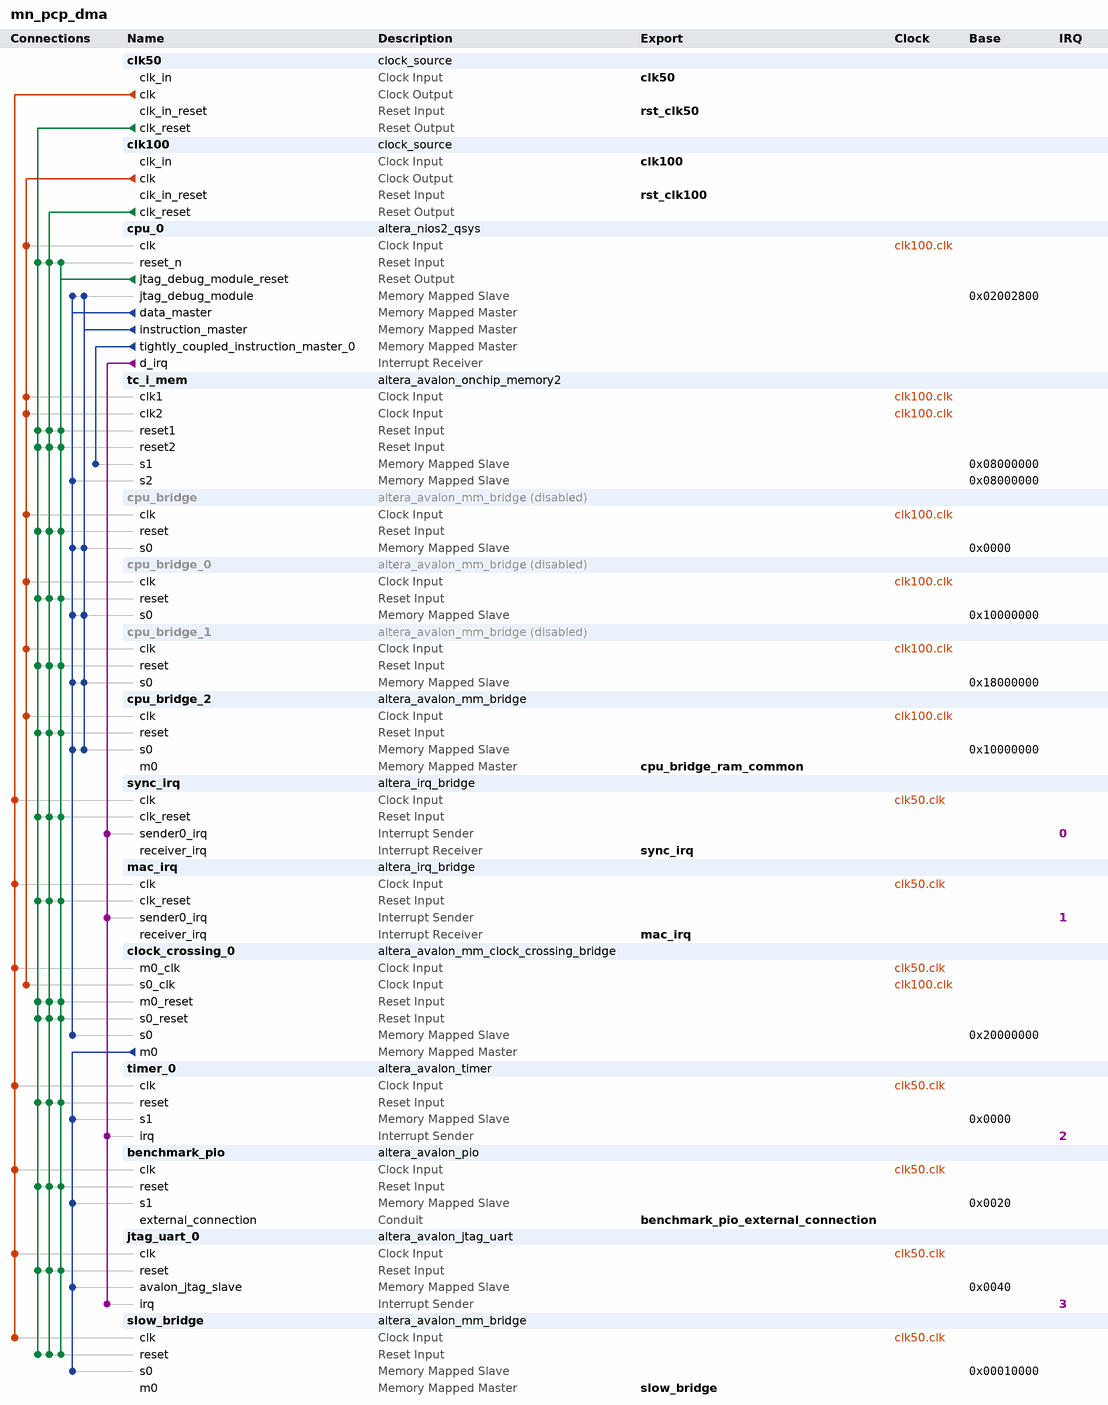
[diagram p0: system contents]
# Platform Designer (Qsys) system mn_pcp_dma, Cyclone IV GX EP4CGX150DF31C7
# Parameters at their usual value, and those the tool derives, are not listed.
package require -exact qsys 14.0
create_system mn_pcp_dma
set_project_property DEVICE_FAMILY {Cyclone IV GX}
set_project_property DEVICE EP4CGX150DF31C7

add_instance clk50 clock_source 14.0
set_instance_parameter_value clk50 clockFrequency 50000000

add_instance clk100 clock_source 14.0
set_instance_parameter_value clk100 clockFrequency 100000000

add_instance cpu_0 altera_nios2_qsys 14.0
set_instance_parameter_value cpu_0 muldiv_divider true
set_instance_parameter_value cpu_0 resetrequest_enabled true
set_instance_parameter_value cpu_0 cpuID 1
set_instance_parameter_value cpu_0 resetSlave tc_i_mem.s1
set_instance_parameter_value cpu_0 exceptionSlave tc_i_mem.s1
set_instance_parameter_value cpu_0 breakSlave cpu_0.jtag_debug_module
set_instance_parameter_value cpu_0 impl Fast
set_instance_parameter_value cpu_0 icache_size 4096
set_instance_parameter_value cpu_0 icache_numTCIM 1
set_instance_parameter_value cpu_0 dcache_size 4096
set_instance_parameter_value cpu_0 dcache_lineSize 4

add_instance tc_i_mem altera_avalon_onchip_memory2 14.0
set_instance_parameter_value tc_i_mem dataWidth 32
set_instance_parameter_value tc_i_mem dualPort true
set_instance_parameter_value tc_i_mem initMemContent true
set_instance_parameter_value tc_i_mem initializationFileName tc_i_mem
set_instance_parameter_value tc_i_mem memorySize 20480

add_instance cpu_bridge altera_avalon_mm_bridge 14.0
set_instance_property cpu_bridge ENABLED false
set_instance_parameter_value cpu_bridge DATA_WIDTH 32
set_instance_parameter_value cpu_bridge ADDRESS_WIDTH 22
set_instance_parameter_value cpu_bridge USE_AUTO_ADDRESS_WIDTH 0
set_instance_parameter_value cpu_bridge ADDRESS_UNITS SYMBOLS
set_instance_parameter_value cpu_bridge MAX_PENDING_RESPONSES 1
set_instance_parameter_value cpu_bridge PIPELINE_COMMAND 0
set_instance_parameter_value cpu_bridge PIPELINE_RESPONSE 0

add_instance cpu_bridge_0 altera_avalon_mm_bridge 14.0
set_instance_property cpu_bridge_0 ENABLED false
set_instance_parameter_value cpu_bridge_0 DATA_WIDTH 32
set_instance_parameter_value cpu_bridge_0 ADDRESS_WIDTH 27
set_instance_parameter_value cpu_bridge_0 USE_AUTO_ADDRESS_WIDTH 0
set_instance_parameter_value cpu_bridge_0 ADDRESS_UNITS SYMBOLS
set_instance_parameter_value cpu_bridge_0 MAX_PENDING_RESPONSES 1
set_instance_parameter_value cpu_bridge_0 PIPELINE_COMMAND 0
set_instance_parameter_value cpu_bridge_0 PIPELINE_RESPONSE 0

add_instance cpu_bridge_1 altera_avalon_mm_bridge 14.0
set_instance_property cpu_bridge_1 ENABLED false
set_instance_parameter_value cpu_bridge_1 DATA_WIDTH 32
set_instance_parameter_value cpu_bridge_1 ADDRESS_WIDTH 27
set_instance_parameter_value cpu_bridge_1 USE_AUTO_ADDRESS_WIDTH 0
set_instance_parameter_value cpu_bridge_1 ADDRESS_UNITS SYMBOLS
set_instance_parameter_value cpu_bridge_1 MAX_PENDING_RESPONSES 4

add_instance cpu_bridge_2 altera_avalon_mm_bridge 14.0
set_instance_parameter_value cpu_bridge_2 DATA_WIDTH 32
set_instance_parameter_value cpu_bridge_2 ADDRESS_WIDTH 28
set_instance_parameter_value cpu_bridge_2 USE_AUTO_ADDRESS_WIDTH 0
set_instance_parameter_value cpu_bridge_2 ADDRESS_UNITS SYMBOLS
set_instance_parameter_value cpu_bridge_2 MAX_PENDING_RESPONSES 1
set_instance_parameter_value cpu_bridge_2 PIPELINE_COMMAND 0
set_instance_parameter_value cpu_bridge_2 PIPELINE_RESPONSE 0

add_instance sync_irq altera_irq_bridge 14.0
set_instance_parameter_value sync_irq IRQ_WIDTH 1

add_instance mac_irq altera_irq_bridge 14.0
set_instance_parameter_value mac_irq IRQ_WIDTH 1

add_instance clock_crossing_0 altera_avalon_mm_clock_crossing_bridge 14.0
set_instance_parameter_value clock_crossing_0 DATA_WIDTH 32
set_instance_parameter_value clock_crossing_0 ADDRESS_WIDTH 17
set_instance_parameter_value clock_crossing_0 USE_AUTO_ADDRESS_WIDTH 0
set_instance_parameter_value clock_crossing_0 MAX_BURST_SIZE 1
set_instance_parameter_value clock_crossing_0 COMMAND_FIFO_DEPTH 4
set_instance_parameter_value clock_crossing_0 RESPONSE_FIFO_DEPTH 4
set_instance_parameter_value clock_crossing_0 MASTER_SYNC_DEPTH 2
set_instance_parameter_value clock_crossing_0 SLAVE_SYNC_DEPTH 2

add_instance timer_0 altera_avalon_timer 14.0
set_instance_parameter_value timer_0 alwaysRun true
set_instance_parameter_value timer_0 fixedPeriod true
set_instance_parameter_value timer_0 period 1
set_instance_parameter_value timer_0 periodUnits MSEC
set_instance_parameter_value timer_0 snapshot false

add_instance benchmark_pio altera_avalon_pio 14.0
set_instance_parameter_value benchmark_pio bitModifyingOutReg true
set_instance_parameter_value benchmark_pio direction Output
set_instance_parameter_value benchmark_pio width 8

add_instance jtag_uart_0 altera_avalon_jtag_uart 14.0
set_instance_parameter_value jtag_uart_0 simInteractiveOptions INTERACTIVE_ASCII_OUTPUT

add_instance slow_bridge altera_avalon_mm_bridge 14.0
set_instance_parameter_value slow_bridge DATA_WIDTH 32
set_instance_parameter_value slow_bridge ADDRESS_WIDTH 16
set_instance_parameter_value slow_bridge USE_AUTO_ADDRESS_WIDTH 0
set_instance_parameter_value slow_bridge ADDRESS_UNITS SYMBOLS
set_instance_parameter_value slow_bridge MAX_PENDING_RESPONSES 1
set_instance_parameter_value slow_bridge PIPELINE_COMMAND 0
set_instance_parameter_value slow_bridge PIPELINE_RESPONSE 0

# connections
add_connection clk50.clk benchmark_pio.clk clock
add_connection clk50.clk clock_crossing_0.m0_clk clock
add_connection clk50.clk jtag_uart_0.clk clock
add_connection clk50.clk mac_irq.clk clock
add_connection clk50.clk slow_bridge.clk clock
add_connection clk50.clk sync_irq.clk clock
add_connection clk50.clk timer_0.clk clock
add_connection clk100.clk clock_crossing_0.s0_clk clock
add_connection clk100.clk cpu_0.clk clock
add_connection clk100.clk cpu_bridge.clk clock
add_connection clk100.clk cpu_bridge_0.clk clock
add_connection clk100.clk cpu_bridge_1.clk clock
add_connection clk100.clk cpu_bridge_2.clk clock
add_connection clk100.clk tc_i_mem.clk1 clock
add_connection clk100.clk tc_i_mem.clk2 clock
add_connection clk50.clk_reset benchmark_pio.reset reset
add_connection clk50.clk_reset clock_crossing_0.m0_reset reset
add_connection clk50.clk_reset clock_crossing_0.s0_reset reset
add_connection clk50.clk_reset cpu_0.reset_n reset
add_connection clk50.clk_reset cpu_bridge.reset reset
add_connection clk50.clk_reset cpu_bridge_0.reset reset
add_connection clk50.clk_reset cpu_bridge_1.reset reset
add_connection clk50.clk_reset cpu_bridge_2.reset reset
add_connection clk50.clk_reset jtag_uart_0.reset reset
add_connection clk50.clk_reset mac_irq.clk_reset reset
add_connection clk50.clk_reset slow_bridge.reset reset
add_connection clk50.clk_reset sync_irq.clk_reset reset
add_connection clk50.clk_reset tc_i_mem.reset1 reset
add_connection clk50.clk_reset tc_i_mem.reset2 reset
add_connection clk50.clk_reset timer_0.reset reset
add_connection clk100.clk_reset benchmark_pio.reset reset
add_connection clk100.clk_reset clock_crossing_0.m0_reset reset
add_connection clk100.clk_reset clock_crossing_0.s0_reset reset
add_connection clk100.clk_reset cpu_0.reset_n reset
add_connection clk100.clk_reset cpu_bridge.reset reset
add_connection clk100.clk_reset cpu_bridge_0.reset reset
add_connection clk100.clk_reset cpu_bridge_1.reset reset
add_connection clk100.clk_reset cpu_bridge_2.reset reset
add_connection clk100.clk_reset jtag_uart_0.reset reset
add_connection clk100.clk_reset mac_irq.clk_reset reset
add_connection clk100.clk_reset slow_bridge.reset reset
add_connection clk100.clk_reset sync_irq.clk_reset reset
add_connection clk100.clk_reset tc_i_mem.reset1 reset
add_connection clk100.clk_reset tc_i_mem.reset2 reset
add_connection clk100.clk_reset timer_0.reset reset
add_connection cpu_0.jtag_debug_module_reset benchmark_pio.reset reset
add_connection cpu_0.jtag_debug_module_reset clock_crossing_0.m0_reset reset
add_connection cpu_0.jtag_debug_module_reset clock_crossing_0.s0_reset reset
add_connection cpu_0.jtag_debug_module_reset cpu_0.reset_n reset
add_connection cpu_0.jtag_debug_module_reset cpu_bridge.reset reset
add_connection cpu_0.jtag_debug_module_reset cpu_bridge_0.reset reset
add_connection cpu_0.jtag_debug_module_reset cpu_bridge_1.reset reset
add_connection cpu_0.jtag_debug_module_reset cpu_bridge_2.reset reset
add_connection cpu_0.jtag_debug_module_reset jtag_uart_0.reset reset
add_connection cpu_0.jtag_debug_module_reset mac_irq.clk_reset reset
add_connection cpu_0.jtag_debug_module_reset slow_bridge.reset reset
add_connection cpu_0.jtag_debug_module_reset sync_irq.clk_reset reset
add_connection cpu_0.jtag_debug_module_reset tc_i_mem.reset1 reset
add_connection cpu_0.jtag_debug_module_reset tc_i_mem.reset2 reset
add_connection cpu_0.jtag_debug_module_reset timer_0.reset reset
add_connection clock_crossing_0.m0 benchmark_pio.s1 avalon
set_connection_parameter_value clock_crossing_0.m0/benchmark_pio.s1 baseAddress 0x0020
add_connection clock_crossing_0.m0 jtag_uart_0.avalon_jtag_slave avalon
set_connection_parameter_value clock_crossing_0.m0/jtag_uart_0.avalon_jtag_slave baseAddress 0x0040
add_connection clock_crossing_0.m0 slow_bridge.s0 avalon
set_connection_parameter_value clock_crossing_0.m0/slow_bridge.s0 baseAddress 0x00010000
add_connection clock_crossing_0.m0 timer_0.s1 avalon
set_connection_parameter_value clock_crossing_0.m0/timer_0.s1 baseAddress 0x0000
add_connection cpu_0.data_master clock_crossing_0.s0 avalon
set_connection_parameter_value cpu_0.data_master/clock_crossing_0.s0 baseAddress 0x20000000
add_connection cpu_0.data_master cpu_0.jtag_debug_module avalon
set_connection_parameter_value cpu_0.data_master/cpu_0.jtag_debug_module baseAddress 0x02002800
add_connection cpu_0.data_master cpu_bridge.s0 avalon
set_connection_parameter_value cpu_0.data_master/cpu_bridge.s0 baseAddress 0x0000
add_connection cpu_0.data_master cpu_bridge_0.s0 avalon
set_connection_parameter_value cpu_0.data_master/cpu_bridge_0.s0 baseAddress 0x10000000
add_connection cpu_0.data_master cpu_bridge_1.s0 avalon
set_connection_parameter_value cpu_0.data_master/cpu_bridge_1.s0 baseAddress 0x18000000
add_connection cpu_0.data_master cpu_bridge_2.s0 avalon
set_connection_parameter_value cpu_0.data_master/cpu_bridge_2.s0 baseAddress 0x10000000
add_connection cpu_0.data_master tc_i_mem.s2 avalon
set_connection_parameter_value cpu_0.data_master/tc_i_mem.s2 baseAddress 0x08000000
add_connection cpu_0.instruction_master cpu_0.jtag_debug_module avalon
set_connection_parameter_value cpu_0.instruction_master/cpu_0.jtag_debug_module baseAddress 0x02002800
add_connection cpu_0.instruction_master cpu_bridge.s0 avalon
set_connection_parameter_value cpu_0.instruction_master/cpu_bridge.s0 baseAddress 0x0000
add_connection cpu_0.instruction_master cpu_bridge_0.s0 avalon
set_connection_parameter_value cpu_0.instruction_master/cpu_bridge_0.s0 baseAddress 0x10000000
add_connection cpu_0.instruction_master cpu_bridge_1.s0 avalon
set_connection_parameter_value cpu_0.instruction_master/cpu_bridge_1.s0 baseAddress 0x18000000
add_connection cpu_0.instruction_master cpu_bridge_2.s0 avalon
set_connection_parameter_value cpu_0.instruction_master/cpu_bridge_2.s0 baseAddress 0x10000000
add_connection cpu_0.tightly_coupled_instruction_master_0 tc_i_mem.s1 avalon
set_connection_parameter_value cpu_0.tightly_coupled_instruction_master_0/tc_i_mem.s1 baseAddress 0x08000000
add_connection cpu_0.d_irq jtag_uart_0.irq interrupt
set_connection_parameter_value cpu_0.d_irq/jtag_uart_0.irq irqNumber 3
add_connection cpu_0.d_irq mac_irq.sender0_irq interrupt
set_connection_parameter_value cpu_0.d_irq/mac_irq.sender0_irq irqNumber 1
add_connection cpu_0.d_irq sync_irq.sender0_irq interrupt
set_connection_parameter_value cpu_0.d_irq/sync_irq.sender0_irq irqNumber 0
add_connection cpu_0.d_irq timer_0.irq interrupt
set_connection_parameter_value cpu_0.d_irq/timer_0.irq irqNumber 2

# exported interfaces
add_interface clk50 clock sink
set_interface_property clk50 EXPORT_OF clk50.clk_in
add_interface rst_clk50 reset sink
set_interface_property rst_clk50 EXPORT_OF clk50.clk_in_reset
add_interface clk100 clock sink
set_interface_property clk100 EXPORT_OF clk100.clk_in
add_interface rst_clk100 reset sink
set_interface_property rst_clk100 EXPORT_OF clk100.clk_in_reset
add_interface benchmark_pio_external_connection conduit end
set_interface_property benchmark_pio_external_connection EXPORT_OF benchmark_pio.external_connection
add_interface slow_bridge avalon master
set_interface_property slow_bridge EXPORT_OF slow_bridge.m0
add_interface sync_irq interrupt receiver
set_interface_property sync_irq EXPORT_OF sync_irq.receiver_irq
add_interface mac_irq interrupt receiver
set_interface_property mac_irq EXPORT_OF mac_irq.receiver_irq
add_interface cpu_bridge_ram_common avalon master
set_interface_property cpu_bridge_ram_common EXPORT_OF cpu_bridge_2.m0

set_interconnect_requirement {$system} qsys_mm.clockCrossingAdapter HANDSHAKE
set_interconnect_requirement {$system} qsys_mm.maxAdditionalLatency 0

save_system mn_pcp_dma.qsys
